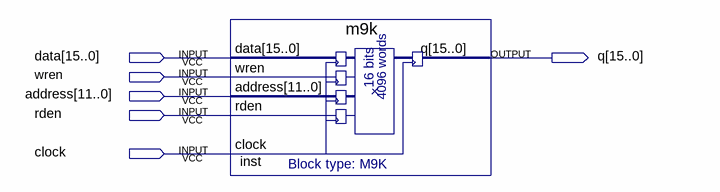
[diagram p0: schematic sheet]
// Quartus schematic m9k_memory.bdf as structural Verilog: 1 symbols, 6 pins
module m9k_memory (
  input  [15:0] data,
  input  wren,
  input  [11:0] address,
  input  rden,
  input  clock,
  output [15:0] q
);

  m9k inst (.data(data), .wren(wren), .address(address), .rden(rden), .clock(clock), .q(q));
endmodule
